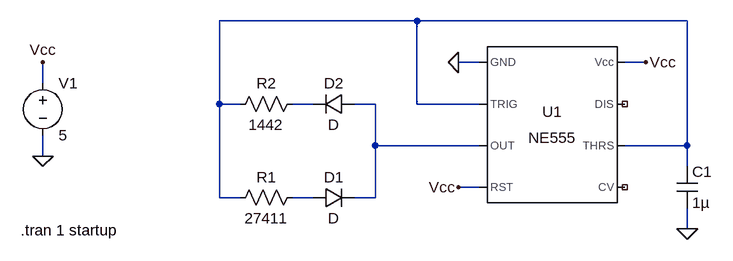
[diagram p0: schematic Draft1.asc]
Draft1.asc, the LTspice schematic file:
Version 4
SHEET 1 880 680
WIRE 48 -48 -256 -48
WIRE 464 -48 48 -48
WIRE 144 16 112 16
WIRE 400 16 368 16
WIRE -528 48 -528 16
WIRE -256 80 -256 -48
WIRE -224 80 -256 80
WIRE -112 80 -144 80
WIRE -16 80 -48 80
WIRE 48 80 48 -48
WIRE 144 80 48 80
WIRE -16 144 -16 80
WIRE 144 144 -16 144
WIRE 464 144 464 -48
WIRE 464 144 368 144
WIRE -528 160 -528 128
WIRE 464 176 464 144
WIRE 144 208 112 208
WIRE -256 224 -256 80
WIRE -224 224 -256 224
WIRE -112 224 -144 224
WIRE -16 224 -16 144
WIRE -16 224 -48 224
WIRE 464 272 464 240
FLAG -528 160 0
FLAG -528 16 Vcc
FLAG 112 16 0
FLAG 400 16 Vcc
FLAG 112 208 Vcc
FLAG 464 272 0
SYMBOL Misc\\NE555 256 112 R0
SYMATTR InstName U1
SYMBOL voltage -528 32 R0
WINDOW 123 0 0 Left 0
WINDOW 39 0 0 Left 0
SYMATTR InstName V1
SYMATTR Value 5
SYMBOL cap 448 176 R0
SYMATTR InstName C1
SYMATTR Value 1µ
SYMBOL res -128 208 R90
WINDOW 0 0 56 VBottom 2
WINDOW 3 32 56 VTop 2
SYMATTR InstName R1
SYMATTR Value 27411
SYMBOL res -128 64 R90
WINDOW 0 0 56 VBottom 2
WINDOW 3 32 56 VTop 2
SYMATTR InstName R2
SYMATTR Value 1442
SYMBOL diode -112 240 R270
WINDOW 0 32 32 VTop 2
WINDOW 3 0 32 VBottom 2
SYMATTR InstName D1
SYMBOL diode -48 64 R90
WINDOW 0 0 32 VBottom 2
WINDOW 3 32 32 VTop 2
SYMATTR InstName D2
TEXT -562 274 Left 2 !.tran 1 startup

The netlist it stands for:
* Draft1.asc
XU1 0 N001 N003 Vcc NC_01 N001 NC_02 Vcc NE555  ; pins GND TRIG OUT RST CV THRS DIS Vcc
V1 Vcc 0 5
C1 N001 0 1µ
R1 N004 N001 27411
R2 N002 N001 1442
D1 N004 N003 D
D2 N003 N002 D
.model D D
.lib standard.dio
.tran 1 startup
.lib NE555.sub
.backanno
.end